# EAGLE design led_board_robot_vs_v2 (EAGLE 8.0.1)
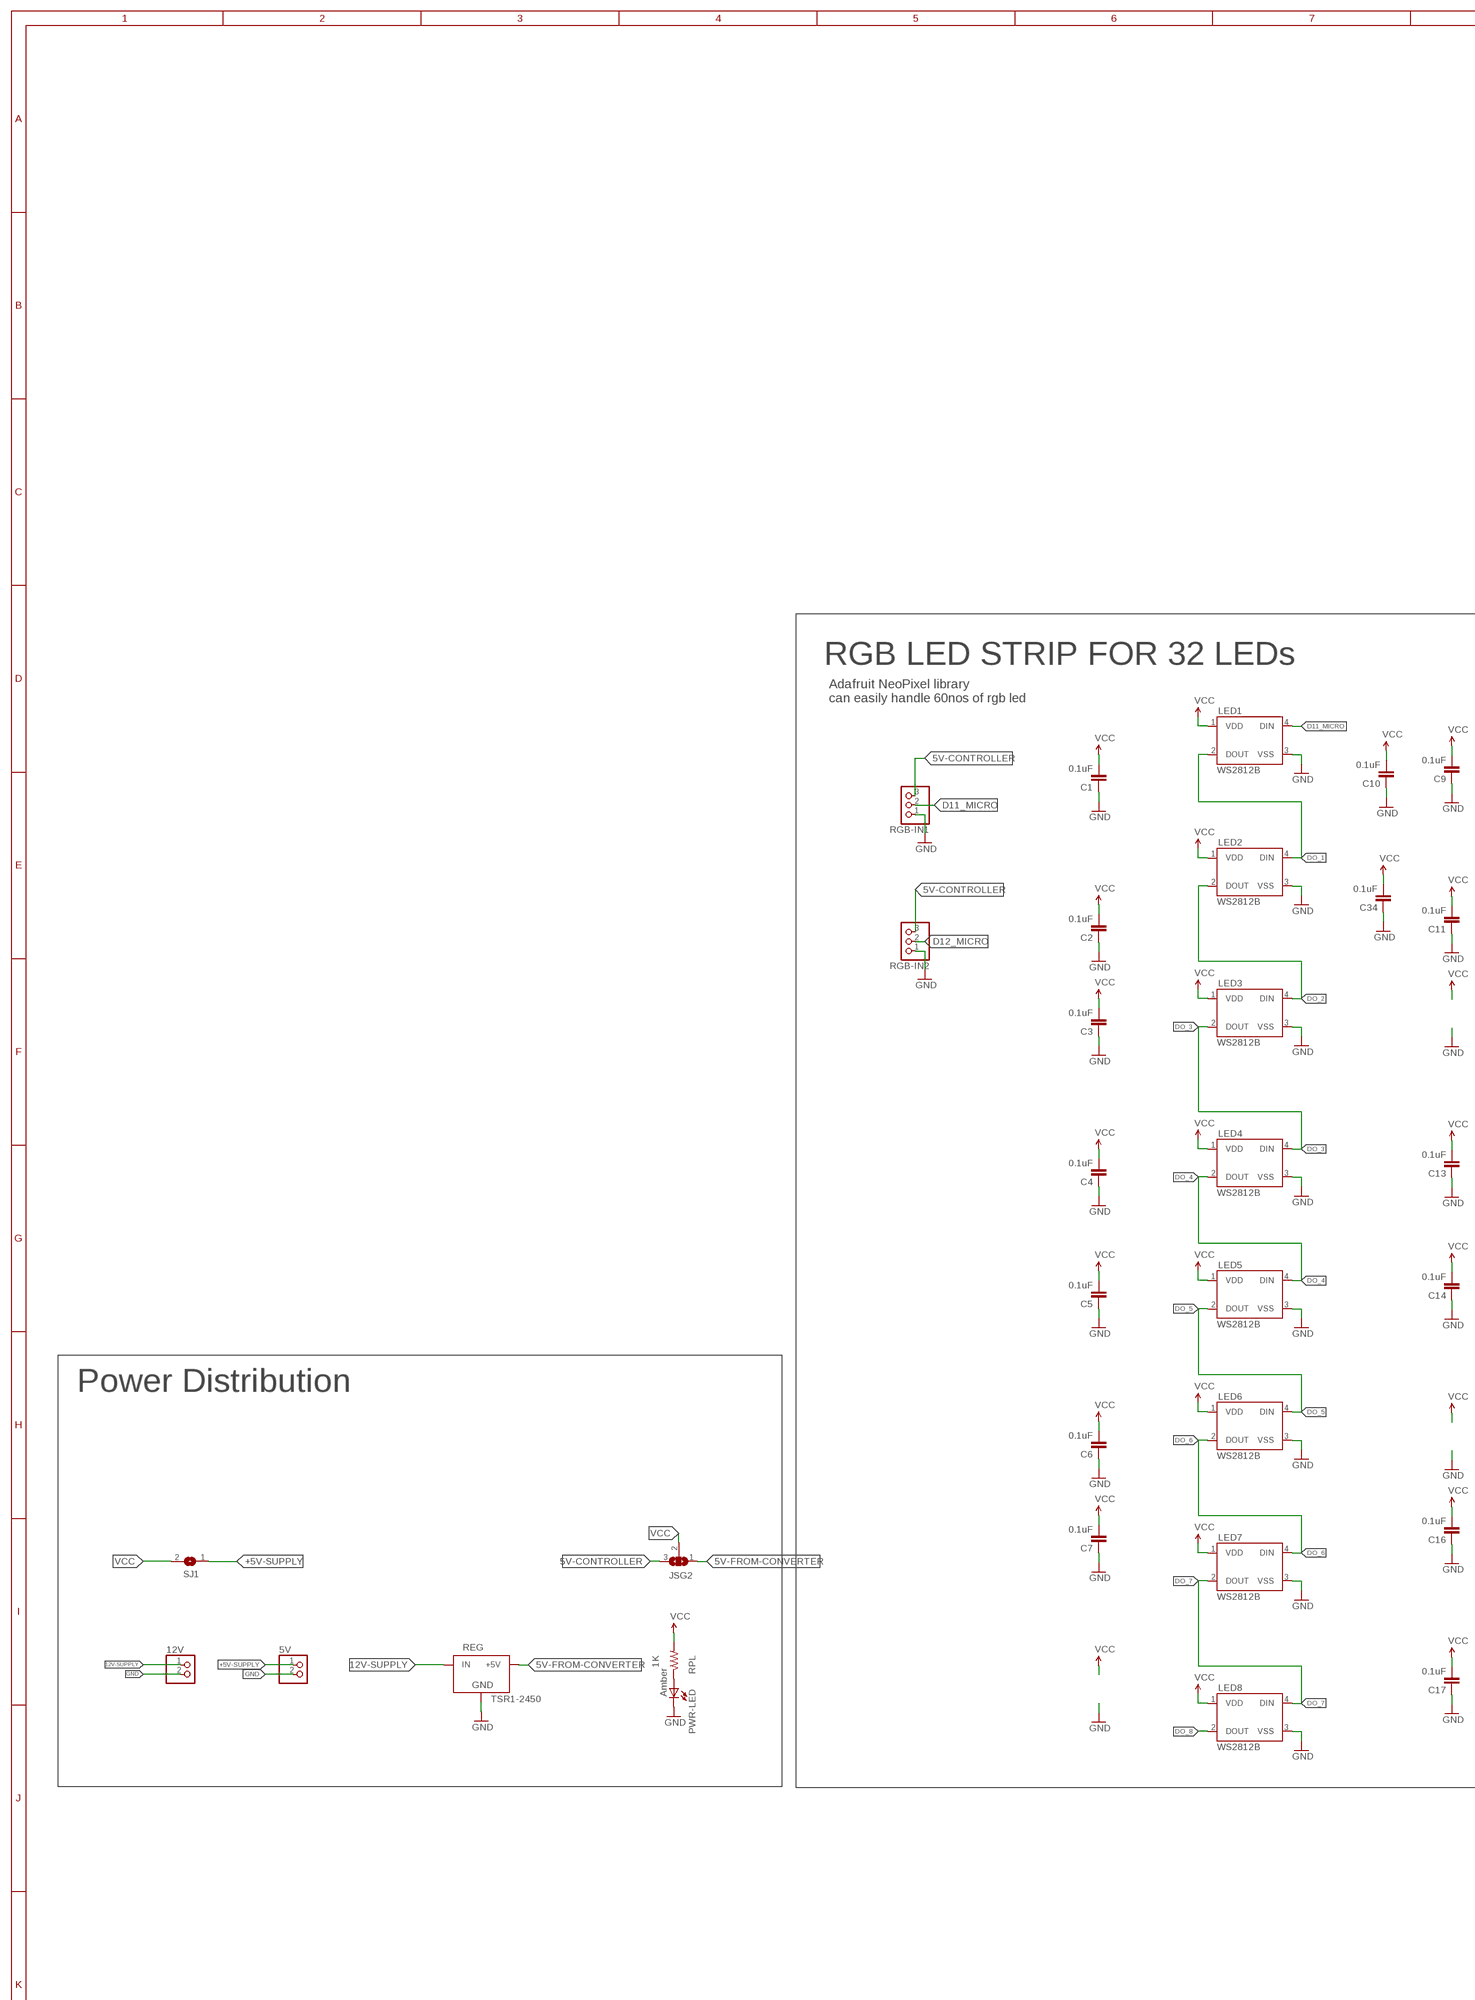
[diagram p0: schematic, sheet 1, part 1 of 3]
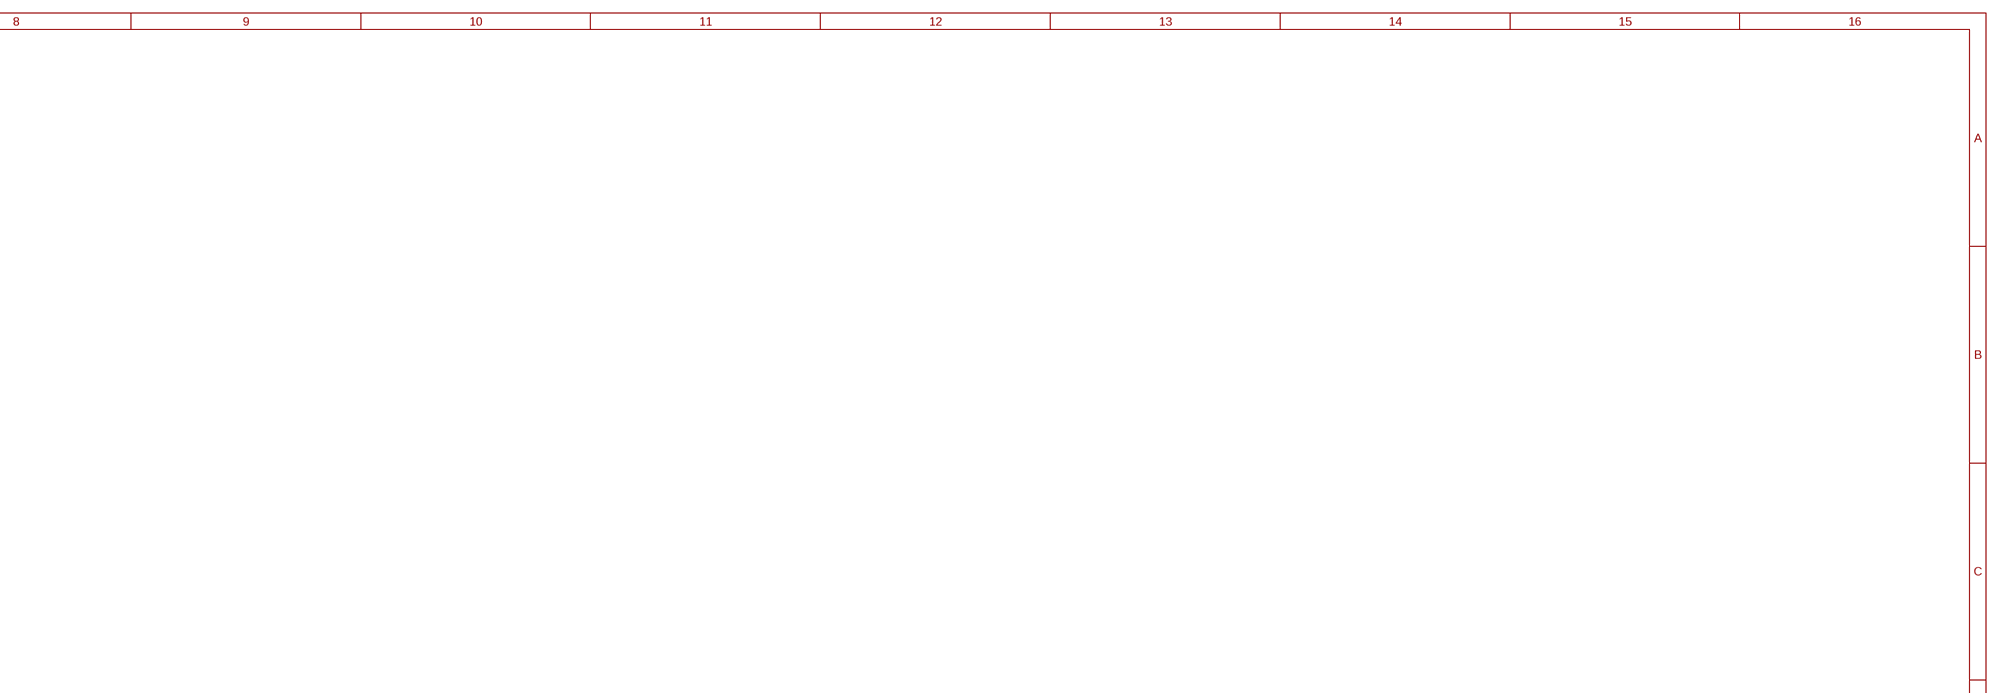
[diagram p1: schematic, sheet 1, part 2 of 3]
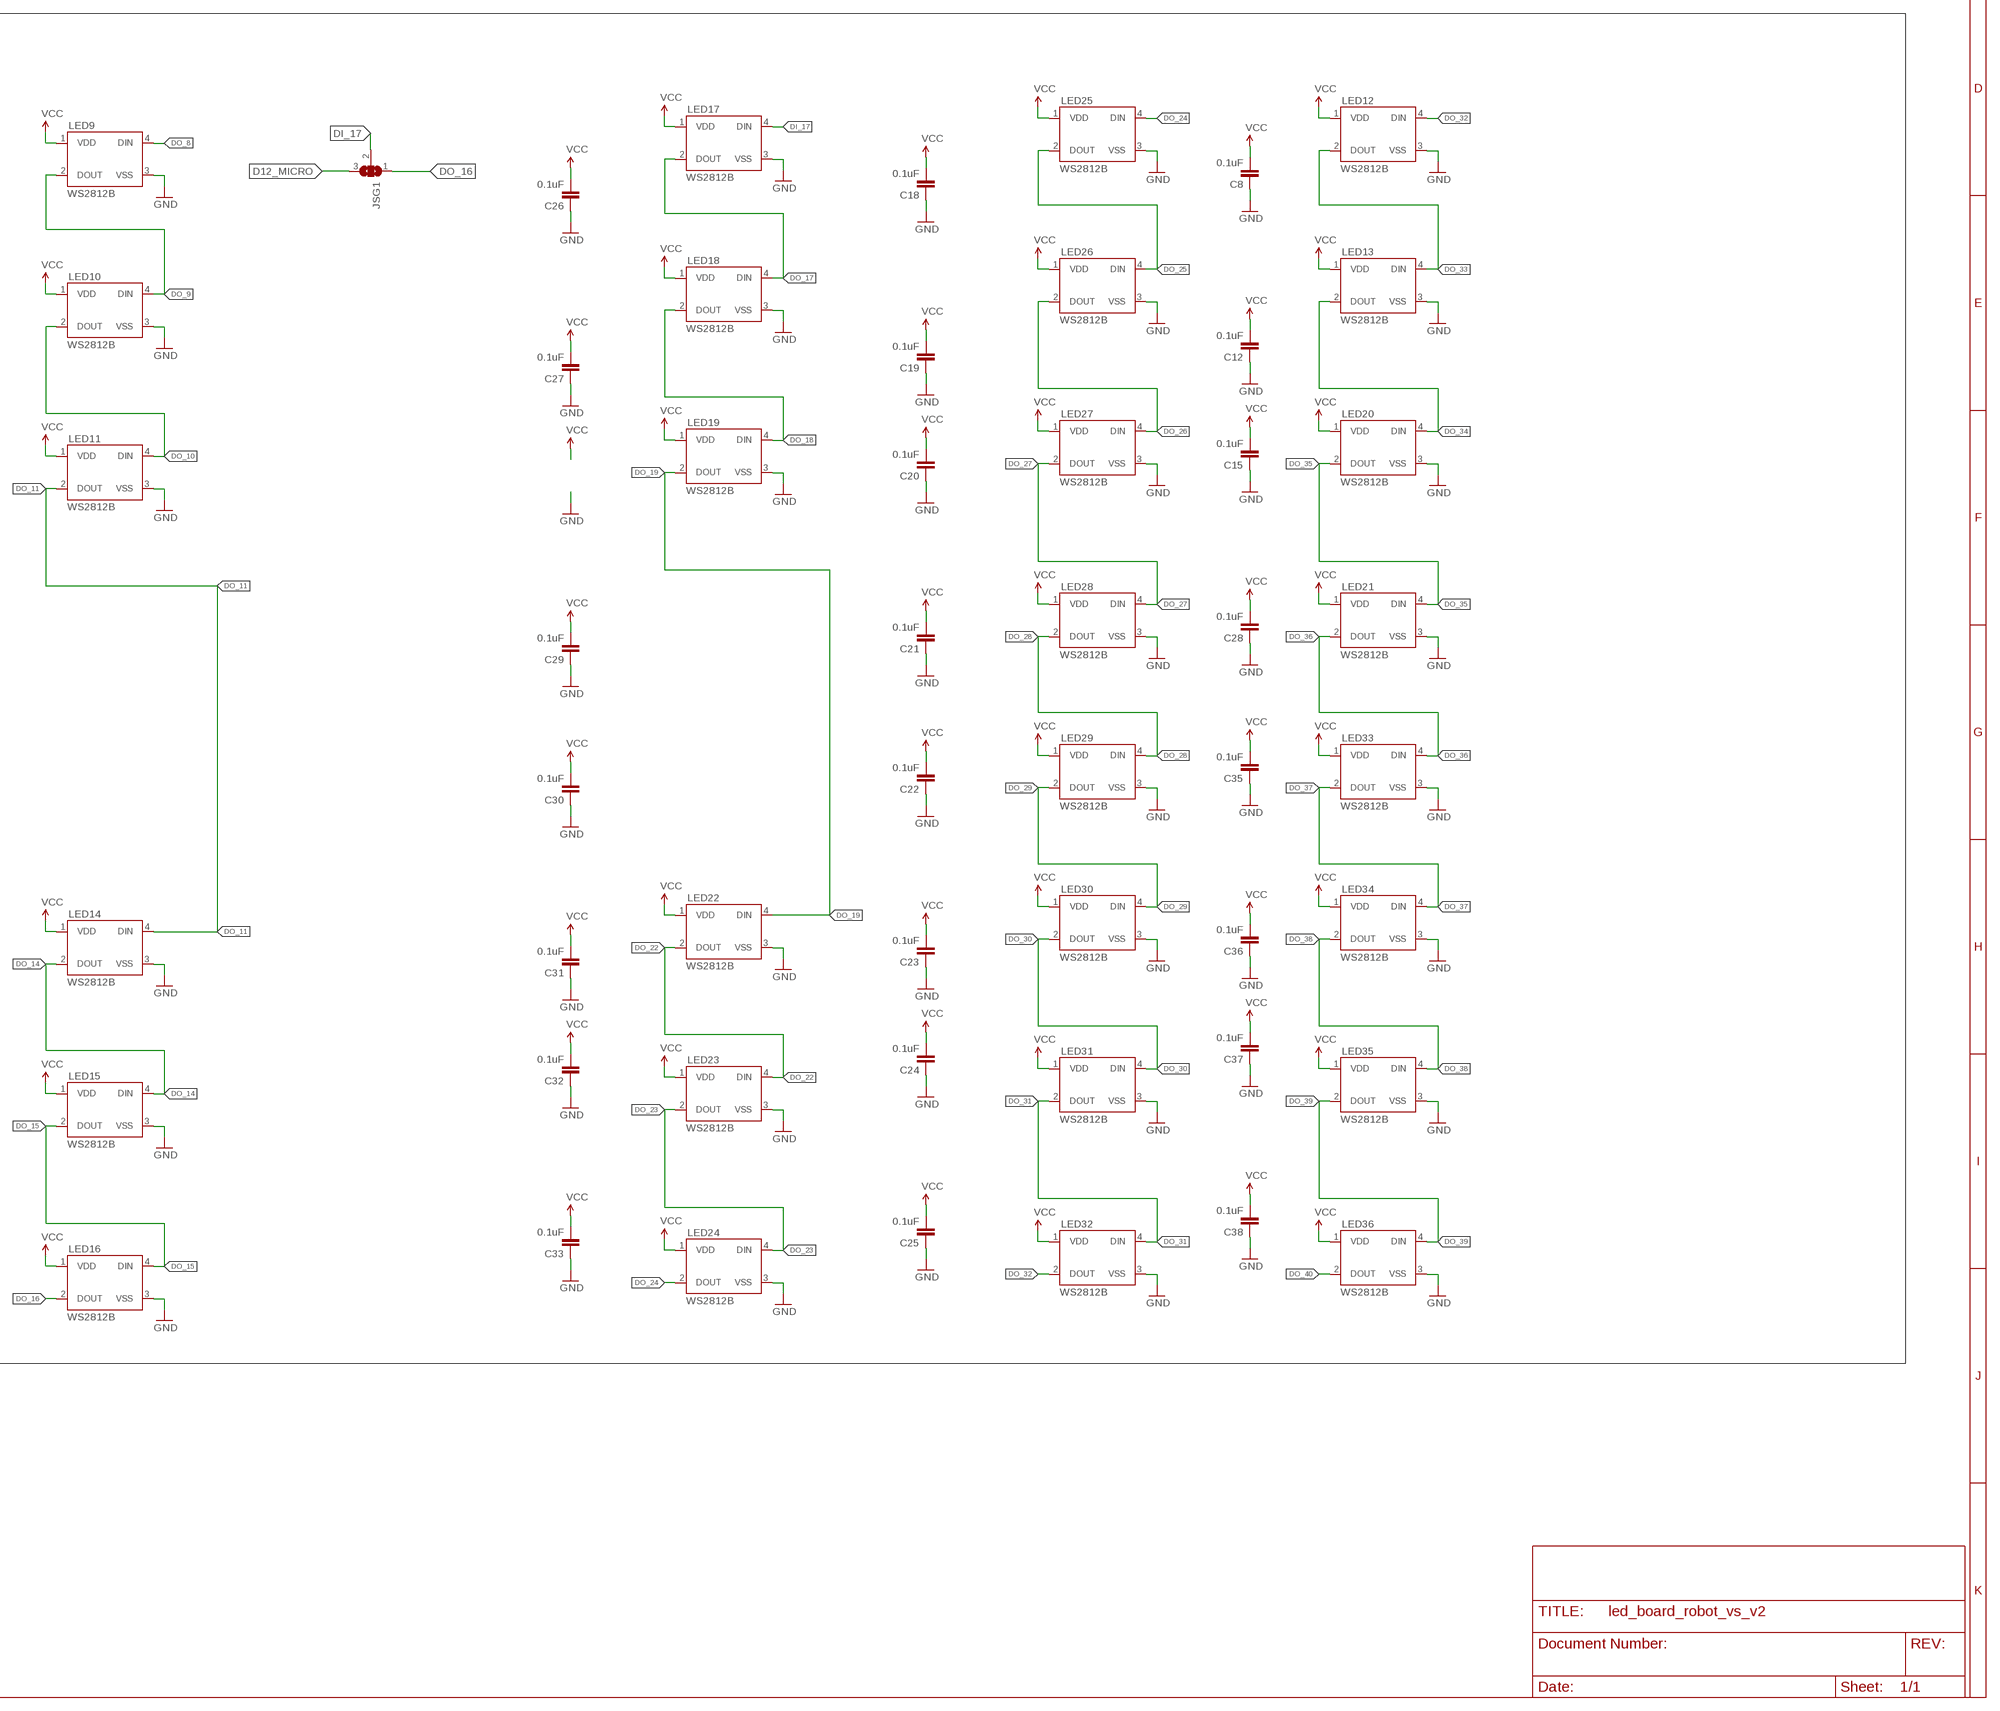
[diagram p2: schematic, sheet 1, part 3 of 3]

## Parts
5V  PINHD-1X2  [1X02]
12V  PINHD-1X2  [1X02]
C1  0.1uF  CAP0603-CAP  [0603-CAP]
C2  0.1uF  CAP0603-CAP  [0603-CAP]
C3  0.1uF  CAP0603-CAP  [0603-CAP]
C4  0.1uF  CAP0603-CAP  [0603-CAP]
C5  0.1uF  CAP0603-CAP  [0603-CAP]
C6  0.1uF  CAP0603-CAP  [0603-CAP]
C7  0.1uF  CAP0603-CAP  [0603-CAP]
C8  0.1uF  CAP0603-CAP  [0603-CAP]
C9  0.1uF  CAP0603-CAP  [0603-CAP]
C10  0.1uF  CAP0603-CAP  [0603-CAP]
C11  0.1uF  CAP0603-CAP  [0603-CAP]
C12  0.1uF  CAP0603-CAP  [0603-CAP]
C13  0.1uF  CAP0603-CAP  [0603-CAP]
C14  0.1uF  CAP0603-CAP  [0603-CAP]
C15  0.1uF  CAP0603-CAP  [0603-CAP]
C16  0.1uF  CAP0603-CAP  [0603-CAP]
C17  0.1uF  CAP0603-CAP  [0603-CAP]
C18  0.1uF  CAP0603-CAP  [0603-CAP]
C19  0.1uF  CAP0603-CAP  [0603-CAP]
C20  0.1uF  CAP0603-CAP  [0603-CAP]
C21  0.1uF  CAP0603-CAP  [0603-CAP]
C22  0.1uF  CAP0603-CAP  [0603-CAP]
C23  0.1uF  CAP0603-CAP  [0603-CAP]
C24  0.1uF  CAP0603-CAP  [0603-CAP]
C25  0.1uF  CAP0603-CAP  [0603-CAP]
C26  0.1uF  CAP0603-CAP  [0603-CAP]
C27  0.1uF  CAP0603-CAP  [0603-CAP]
C28  0.1uF  CAP0603-CAP  [0603-CAP]
C29  0.1uF  CAP0603-CAP  [0603-CAP]
C30  0.1uF  CAP0603-CAP  [0603-CAP]
C31  0.1uF  CAP0603-CAP  [0603-CAP]
C32  0.1uF  CAP0603-CAP  [0603-CAP]
C33  0.1uF  CAP0603-CAP  [0603-CAP]
C34  0.1uF  CAP0603-CAP  [0603-CAP]
C35  0.1uF  CAP0603-CAP  [0603-CAP]
C36  0.1uF  CAP0603-CAP  [0603-CAP]
C37  0.1uF  CAP0603-CAP  [0603-CAP]
C38  0.1uF  CAP0603-CAP  [0603-CAP]
JSG1  SJ2WW  [SJ_2W]
JSG2  SJ2WW  [SJ_2W]
LED1  WS2812B  [WS2812B]
LED2  WS2812B  [WS2812B]
LED3  WS2812B  [WS2812B]
LED4  WS2812B  [WS2812B]
LED5  WS2812B  [WS2812B]
LED6  WS2812B  [WS2812B]
LED7  WS2812B  [WS2812B]
LED8  WS2812B  [WS2812B]
LED9  WS2812B  [WS2812B]
LED10  WS2812B  [WS2812B]
LED11  WS2812B  [WS2812B]
LED12  WS2812B  [WS2812B]
LED13  WS2812B  [WS2812B]
LED14  WS2812B  [WS2812B]
LED15  WS2812B  [WS2812B]
LED16  WS2812B  [WS2812B]
LED17  WS2812B  [WS2812B]
LED18  WS2812B  [WS2812B]
LED19  WS2812B  [WS2812B]
LED20  WS2812B  [WS2812B]
LED21  WS2812B  [WS2812B]
LED22  WS2812B  [WS2812B]
LED23  WS2812B  [WS2812B]
LED24  WS2812B  [WS2812B]
LED25  WS2812B  [WS2812B]
LED26  WS2812B  [WS2812B]
LED27  WS2812B  [WS2812B]
LED28  WS2812B  [WS2812B]
LED29  WS2812B  [WS2812B]
LED30  WS2812B  [WS2812B]
LED31  WS2812B  [WS2812B]
LED32  WS2812B  [WS2812B]
LED33  WS2812B  [WS2812B]
LED34  WS2812B  [WS2812B]
LED35  WS2812B  [WS2812B]
LED36  WS2812B  [WS2812B]
PWR-LED  Amber  LED0603  [LED-0603]
REG  TSR1-2450  [TSR-1]
RGB-IN1  PINHD-1X3  [1X03]
RGB-IN2  PINHD-1X3  [1X03]
RPL  1K  RESISTOR0603-RES  [0603-RES]
SJ1  SJW  [SJW]

## Nets
5V-CONTROLLER [power]: JSG2.3 RGB-IN1.3 RGB-IN2.3
5V-FROM-CONVERTER [power]: JSG2.1 REG.3(+5V)
12V-SUPPLY [power]: 12V.1 REG.1(IN)
+5V-SUPPLY [power]: 5V.1 SJ1.1
D11_MICRO [power]: LED1.4(DIN) RGB-IN1.2
D12_MICRO [power]: JSG1.3 RGB-IN2.2
DI_17: JSG1.2 LED17.4(DIN)
DO_1: LED1.2(DOUT) LED2.4(DIN)
DO_2 [power]: LED2.2(DOUT) LED3.4(DIN)
DO_3 [power]: LED3.2(DOUT) LED4.4(DIN)
DO_4 [power]: LED4.2(DOUT) LED5.4(DIN)
DO_5 [power]: LED5.2(DOUT) LED6.4(DIN)
DO_6 [power]: LED6.2(DOUT) LED7.4(DIN)
DO_7 [power]: LED7.2(DOUT) LED8.4(DIN)
DO_8: LED8.2(DOUT) LED9.4(DIN)
DO_9: LED9.2(DOUT) LED10.4(DIN)
DO_10: LED10.2(DOUT) LED11.4(DIN)
DO_11 [power]: LED11.2(DOUT) LED14.4(DIN)
DO_14 [power]: LED14.2(DOUT) LED15.4(DIN)
DO_15 [power]: LED15.2(DOUT) LED16.4(DIN)
DO_16 [power]: JSG1.1 LED16.2(DOUT)
DO_17 [power]: LED17.2(DOUT) LED18.4(DIN)
DO_18 [power]: LED18.2(DOUT) LED19.4(DIN)
DO_19: LED19.2(DOUT) LED22.4(DIN)
DO_22 [power]: LED22.2(DOUT) LED23.4(DIN)
DO_23 [power]: LED23.2(DOUT) LED24.4(DIN)
DO_24 [power]: LED24.2(DOUT) LED25.4(DIN)
DO_25 [power]: LED25.2(DOUT) LED26.4(DIN)
DO_26 [power]: LED26.2(DOUT) LED27.4(DIN)
DO_27 [power]: LED27.2(DOUT) LED28.4(DIN)
DO_28: LED28.2(DOUT) LED29.4(DIN)
DO_29: LED29.2(DOUT) LED30.4(DIN)
DO_30: LED30.2(DOUT) LED31.4(DIN)
DO_31: LED31.2(DOUT) LED32.4(DIN)
DO_32 [power]: LED12.4(DIN) LED32.2(DOUT)
DO_33 [power]: LED12.2(DOUT) LED13.4(DIN)
DO_34 [power]: LED13.2(DOUT) LED20.4(DIN)
DO_35 [power]: LED20.2(DOUT) LED21.4(DIN)
DO_36: LED21.2(DOUT) LED33.4(DIN)
DO_37: LED33.2(DOUT) LED34.4(DIN)
DO_38: LED34.2(DOUT) LED35.4(DIN)
DO_39: LED35.2(DOUT) LED36.4(DIN)
DO_40 [power]: LED36.2(DOUT)
GND [power]: 5V.2 12V.2 C1.1 C2.1 C3.1 C4.1 C5.1 C6.1 C7.1 C8.1 C9.1 C10.1 C11.1 C12.1 C13.1 C14.1 C15.1 C16.1 C17.1 C18.1 C19.1 C20.1 C21.1 C22.1 C23.1 C24.1 C25.1 C26.1 C27.1 C28.1 C29.1 C30.1 C31.1 C32.1 C33.1 C34.1 C35.1 C36.1 C37.1 C38.1 LED1.3(VSS) LED2.3(VSS) LED3.3(VSS) LED4.3(VSS) LED5.3(VSS) LED6.3(VSS) LED7.3(VSS) LED8.3(VSS) LED9.3(VSS) LED10.3(VSS) LED11.3(VSS) LED12.3(VSS) LED13.3(VSS) LED14.3(VSS) LED15.3(VSS) LED16.3(VSS) LED17.3(VSS) LED18.3(VSS) LED19.3(VSS) LED20.3(VSS) LED21.3(VSS) LED22.3(VSS) LED23.3(VSS) LED24.3(VSS) LED25.3(VSS) LED26.3(VSS) LED27.3(VSS) LED28.3(VSS) LED29.3(VSS) LED30.3(VSS) LED31.3(VSS) LED32.3(VSS) LED33.3(VSS) LED34.3(VSS) LED35.3(VSS) LED36.3(VSS) PWR-LED.C REG.2(GND) RGB-IN1.1 RGB-IN2.1
N$17: PWR-LED.A RPL.1
VCC [power]: C1.2 C2.2 C3.2 C4.2 C5.2 C6.2 C7.2 C8.2 C9.2 C10.2 C11.2 C12.2 C13.2 C14.2 C15.2 C16.2 C17.2 C18.2 C19.2 C20.2 C21.2 C22.2 C23.2 C24.2 C25.2 C26.2 C27.2 C28.2 C29.2 C30.2 C31.2 C32.2 C33.2 C34.2 C35.2 C36.2 C37.2 C38.2 JSG2.2 LED1.1(VDD) LED2.1(VDD) LED3.1(VDD) LED4.1(VDD) LED5.1(VDD) LED6.1(VDD) LED7.1(VDD) LED8.1(VDD) LED9.1(VDD) LED10.1(VDD) LED11.1(VDD) LED12.1(VDD) LED13.1(VDD) LED14.1(VDD) LED15.1(VDD) LED16.1(VDD) LED17.1(VDD) LED18.1(VDD) LED19.1(VDD) LED20.1(VDD) LED21.1(VDD) LED22.1(VDD) LED23.1(VDD) LED24.1(VDD) LED25.1(VDD) LED26.1(VDD) LED27.1(VDD) LED28.1(VDD) LED29.1(VDD) LED30.1(VDD) LED31.1(VDD) LED32.1(VDD) LED33.1(VDD) LED34.1(VDD) LED35.1(VDD) LED36.1(VDD) RPL.2 SJ1.2

## Notes on the sheet
- RGB LED STRIP FOR 32 LEDs
- Adafruit NeoPixel library 
  can easily handle 60nos of rgb led
- Power Distribution

## Library data of the parts
5V 12V = pinhead:PINHD-1X2: PIN HEADER
C1-C38 = SparkFun:CAP: Capacitor Standard 0603 ceramic capacitor, and 0.1" leaded capacitor.
JSG1 JSG2 = jumper:SJ2W: SMD solder JUMPER
LED1-LED36 = SparkFun-LED:WS2812B: WS2812B - Intelligent control LED integrated light source Technical Specifications: Power Supply Voltage (VDD): 3.5 to 5.3 V Input Voltage (VI): -0.5 to VDD+0.5 V Operating Junction Temperature (Topt): -25°C to +80°C Storage Temperature Range (Tstg): -55°C to +150°C; PROD_ID: DIO-12503
PWR-LED = SparkFun:LED: LEDs Standard schematic elements and footprints for 5mm, 3mm, 1206, and 0603 sized LEDs. 5mm - Spark Fun Electronics SKU : COM-00529 (and others)
REG = SteelCaveRobotics-Power:TSR1-2450: Traco Power TSR 1-2450 5.0v switching regulator
RGB-IN1 RGB-IN2 = pinhead:PINHD-1X3: PIN HEADER
RPL = SparkFun:RESISTOR: Resistor Basic schematic elements and footprints for 0603, 1206, and PTH resistors.
SJ1 = jumper:SJ: SMD solder JUMPER

## Net classes
0 default: width 0.762 mm, drill 0.762 mm, clearance 0.559 mm
1 power: width 0.762 mm, drill 0.762 mm, clearance 0.381 mm
2 Massa: width 0.8 mm, drill 0.6 mm, clearance 0.2 mm
3 Mot: width 1.2 mm, drill 0.8 mm, clearance 0.005 mm
4 motor: width 0.305 mm, drill 0.406 mm, clearance 0.203 mm

## Board
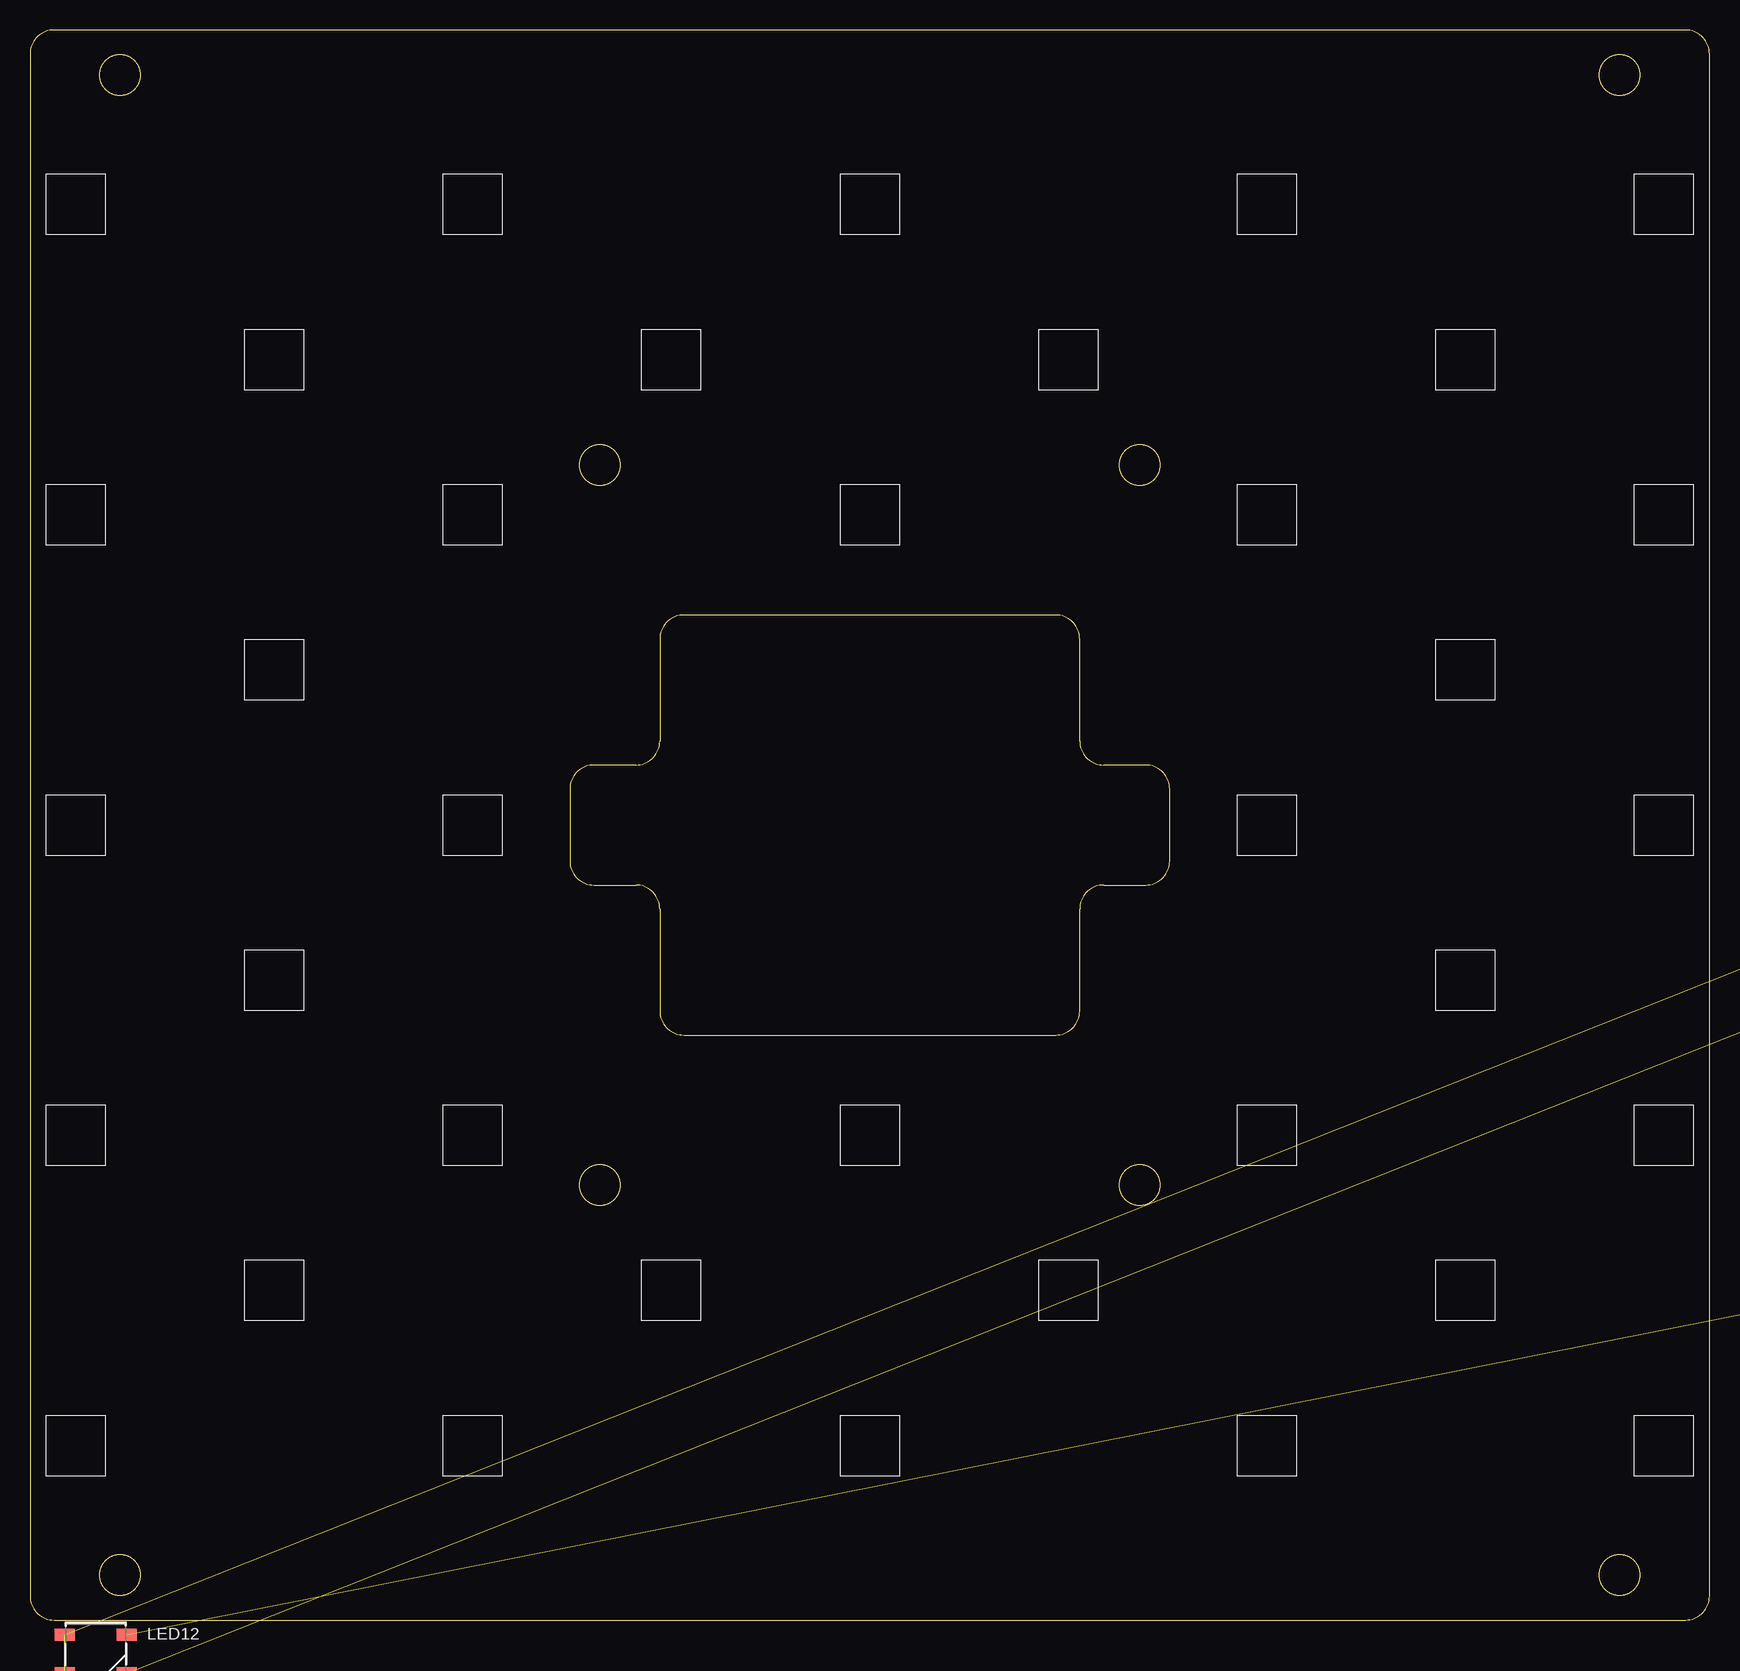
[diagram p3: board, top side]
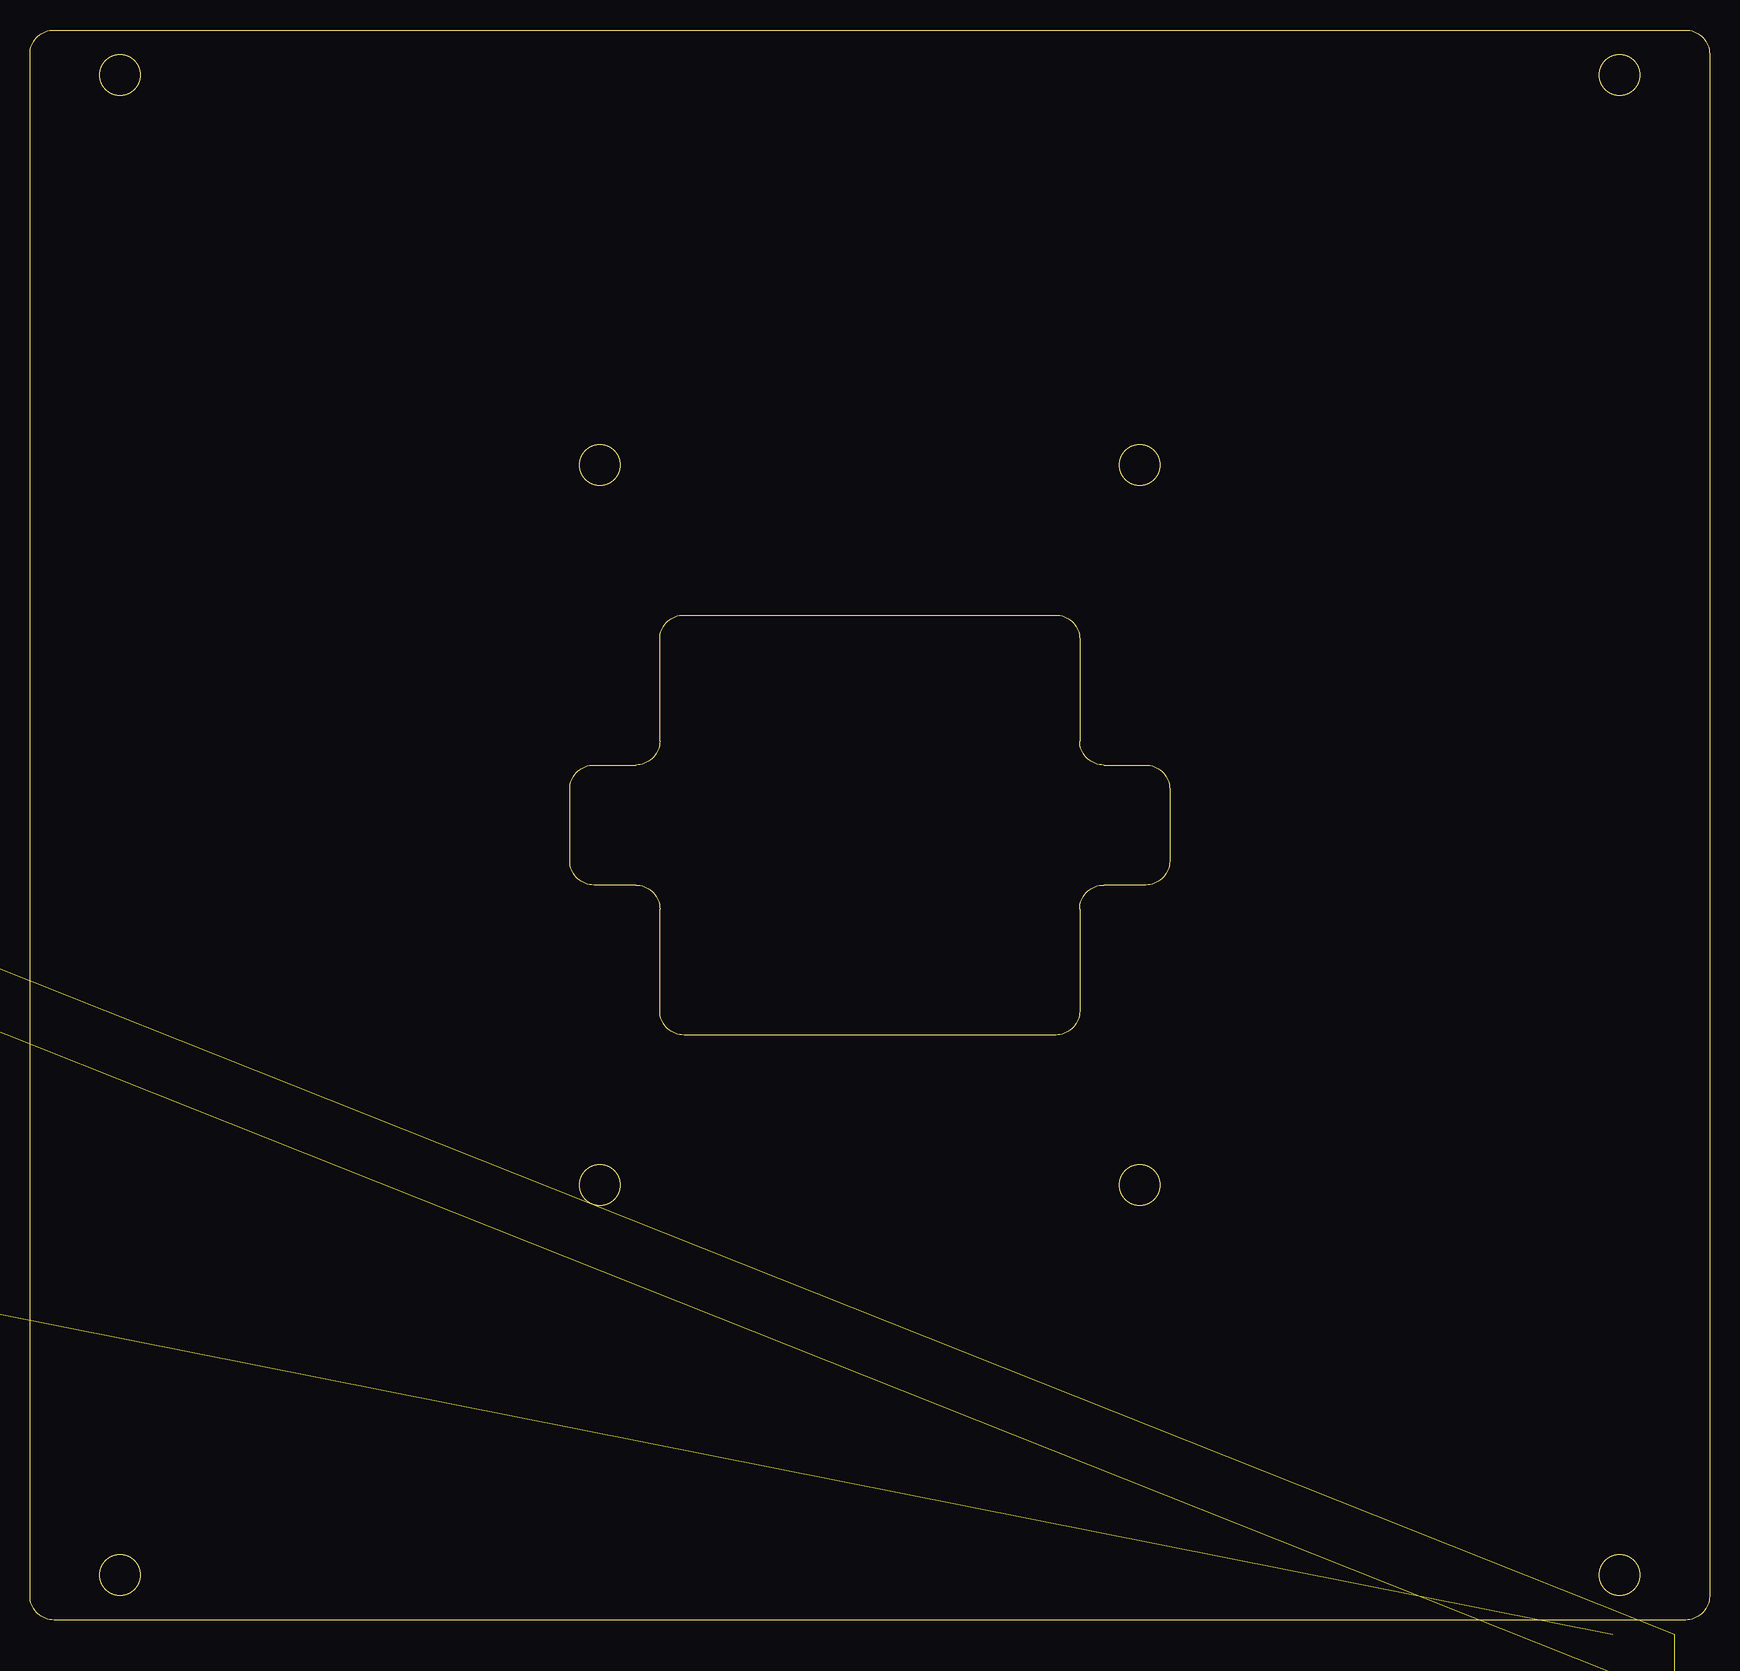
[diagram p4: board, bottom side, seen from below]

Size 140 x 132.5 mm. Coordinates in mm from the lower left corner, seen from the top.
Outline: 2,0 138,0 arc90 140,2 140,130.5 arc90 138,132.5 2,132.5 arc90 0,130.5 0,2 arc90 2,0
Outline: 52.5,59.25 52.5,50.75 arc90 54.5,48.75 85.5,48.75 arc90 87.5,50.75 87.5,59.25 arc-90 89.5,61.25 93,61.25 arc90 95,63.25 95,69.25 arc90 93,71.25 89.5,71.25 arc-90 87.5,73.25 87.5,81.75 arc90 85.5,83.75 54.5,83.75 arc90 52.5,81.75 52.5,73.25 arc-90 50.5,71.25 47,71.25 arc90 45,69.25 45,63.25 arc90 47,61.25 50.5,61.25 arc-90 52.5,59.25
Outline: circle at 132.5,128.75 radius 1.7
Outline: circle at 7.5,3.75 radius 1.7
Outline: circle at 7.5,128.75 radius 1.7
Outline: circle at 132.5,3.75 radius 1.7
Outline: circle at 47.5,96.25 radius 1.7
Outline: circle at 47.5,36.25 radius 1.7
Outline: circle at 92.5,96.25 radius 1.7
Outline: circle at 92.5,36.25 radius 1.7
Copper layers (1*16): Top 0.035mm / dielectric 1.5mm / Bottom 0.035mm
Design rules "default": minimum track width 10mil, minimum drill 24mil, track to track 8mil, track to pad 8mil, pad to pad 8mil, via to via 8mil, smd to smd 8mil, copper to edge 40mil, drill to drill 8mil, minimum pad ring 10mil, minimum via ring 8mil, stop-mask expansion 4mil, vias tented up to drill 0mil, thermal gap 10mil

### Footprints (pad centres in the part's own frame; a part is rotated, then mirrored left to right if it is on the bottom)
1X02 = drill 1.016 long: 1 -1.27,0; 2 1.27,0
0603-CAP = smd 1.1 x 1: 1 -0.85,0; 2 0.85,0
SJ_2W = smd 1.27 x 2.54: 1 -2.54,0; 2 0,0; 3 2.54,0
WS2812B = smd 1.651 x 1: 1 -2.577,1.6; 2 -2.577,-1.6; 3 2.577,-1.6; 4 2.577,1.6
LED-0603 = smd 0.8 x 0.8: A 0,-0.75; C 0,0.75
TSR-1 = drill 0.8 pad 1.8 square: 1 -2.54,-1.5 | drill 0.8 pad 1.8 octagon: 2 0,-1.5; 3 2.54,-1.5
1X03 = drill 1.016 long: 1 -2.54,0; 2 0,0; 3 2.54,0
0603-RES = smd 1.1 x 1: 1 -0.85,0; 2 0.85,0
SJW = smd 1.27 x 2.54: 1 -1.27,0; 2 1.27,0

### Placement (x,y rotation side)
5V  279.04,221.01 180 top  (outside the outline)
12V  287.29,221.01 180 top  (outside the outline)
C1  410.67,98.45 90 top  (outside the outline)
C2  515.13,98.55 90 top  (outside the outline)
C3  480.13,98.55 90 top  (outside the outline)
C4  339.63,98.55 90 top  (outside the outline)
C5  304.83,98.55 90 top  (outside the outline)
C6  269.13,98.35 90 top  (outside the outline)
C7  514.13,134.55 90 top  (outside the outline)
C8  2.69,-46.02 0 top  (outside the outline)
C9  478.83,134.65 90 top  (outside the outline)
C10  445.97,98.36 90 top  (outside the outline)
C11  442.93,134.55 90 top  (outside the outline)
C12  8.28,-46.02 0 top  (outside the outline)
C13  322.43,134.55 90 top  (outside the outline)
C14  304.23,134.65 90 top  (outside the outline)
C15  2.69,-49.07 0 top  (outside the outline)
C16  268.93,134.45 90 top  (outside the outline)
C17  443.53,170.45 90 top  (outside the outline)
C18  304.96,220 270 top  (outside the outline)
C19  269.73,206.35 90 top  (outside the outline)
C20  374.73,98.45 90 top  (outside the outline)
C21  304.73,206.15 90 top  (outside the outline)
C22  267.73,170.35 90 top  (outside the outline)
C23  339.63,206.55 90 top  (outside the outline)
C24  304.13,170.35 90 top  (outside the outline)
C25  373.53,206.65 90 top  (outside the outline)
C26  323.02,170.66 90 top  (outside the outline)
C27  408.33,206.55 90 top  (outside the outline)
C28  8.28,-49.07 0 top  (outside the outline)
C29  443.93,206.55 90 top  (outside the outline)
C30  478.93,170.55 90 top  (outside the outline)
C31  479.53,206.55 90 top  (outside the outline)
C32  514.73,170.55 90 top  (outside the outline)
C33  515.13,206.65 90 top  (outside the outline)
C34  308.82,220 270 top  (outside the outline)
C35  2.69,-52.11 0 top  (outside the outline)
C36  8.28,-52.11 0 top  (outside the outline)
C37  2.69,-55.16 0 top  (outside the outline)
C38  8.28,-55.16 0 top  (outside the outline)
JSG1  325.03,217.09 270 top  (outside the outline)
JSG2  313.21,217.09 270 top  (outside the outline)
LED1  260.97,206.66 0 top  (outside the outline)
LED2  295.97,206.66 0 top  (outside the outline)
LED3  330.97,206.66 0 top  (outside the outline)
LED4  365.97,206.66 0 top  (outside the outline)
LED5  400.97,206.66 0 top  (outside the outline)
LED6  435.97,206.66 0 top  (outside the outline)
LED7  470.97,206.66 0 top  (outside the outline)
LED8  505.97,206.66 0 top  (outside the outline)
LED9  260.97,170.66 0 top  (outside the outline)
LED10  295.97,170.66 0 top  (outside the outline)
LED11  330.97,170.66 0 top  (outside the outline)
LED12  5.48,-2.84 0 top
LED13  5.48,-8.43 0 top  (outside the outline)
LED14  435.97,170.66 0 top  (outside the outline)
LED15  470.97,170.66 0 top  (outside the outline)
LED16  505.97,170.66 0 top  (outside the outline)
LED17  260.97,134.66 0 top  (outside the outline)
LED18  295.97,134.66 0 top  (outside the outline)
LED19  330.97,134.66 0 top  (outside the outline)
LED20  5.48,-14.01 0 top  (outside the outline)
LED21  5.48,-19.6 0 top  (outside the outline)
LED22  435.97,134.66 0 top  (outside the outline)
LED23  470.97,134.66 0 top  (outside the outline)
LED24  505.97,134.66 0 top  (outside the outline)
LED25  260.97,98.66 0 top  (outside the outline)
LED26  295.97,98.66 0 top  (outside the outline)
LED27  330.97,98.66 0 top  (outside the outline)
LED28  365.97,98.66 0 top  (outside the outline)
LED29  400.97,98.66 0 top  (outside the outline)
LED30  435.97,98.66 0 top  (outside the outline)
LED31  470.97,98.66 0 top  (outside the outline)
LED32  505.97,98.66 0 top  (outside the outline)
LED33  5.48,-25.19 0 top  (outside the outline)
LED34  5.48,-30.78 0 top  (outside the outline)
LED35  5.48,-36.37 0 top  (outside the outline)
LED36  5.48,-41.95 0 top  (outside the outline)
PWR-LED  308.82,215.41 0 top  (outside the outline)
REG  281.35,208.68 180 top  (outside the outline)
RGB-IN1  270.83,221.03 0 bottom  (outside the outline)
RGB-IN2  261.25,221.01 0 bottom  (outside the outline)
RPL  304.96,215.72 90 top  (outside the outline)
SJ1  319.29,215.88 90 top  (outside the outline)

### Tracks (layer width: path | path; a pad name or v marks a point on that pad's centre or on a via)
5V-CONTROLLER  (2 unrouted)
5V-FROM-CONVERTER  (1 unrouted)
12V-SUPPLY  (1 unrouted)
+5V-SUPPLY  (1 unrouted)
D11_MICRO  (1 unrouted)
D12_MICRO  (1 unrouted)
DI_17  (1 unrouted)
DO_1  (1 unrouted)
DO_2  (1 unrouted)
DO_3  (1 unrouted)
DO_4  (1 unrouted)
DO_5  (1 unrouted)
DO_6  (1 unrouted)
DO_7  (1 unrouted)
DO_8  (1 unrouted)
DO_9  (1 unrouted)
DO_10  (1 unrouted)
DO_11  (1 unrouted)
DO_14  (1 unrouted)
DO_15  (1 unrouted)
DO_16  (1 unrouted)
DO_17  (1 unrouted)
DO_18  (1 unrouted)
DO_19  (1 unrouted)
DO_22  (1 unrouted)
DO_23  (1 unrouted)
DO_24  (1 unrouted)
DO_25  (1 unrouted)
DO_26  (1 unrouted)
DO_27  (1 unrouted)
DO_28  (1 unrouted)
DO_29  (1 unrouted)
DO_30  (1 unrouted)
DO_31  (1 unrouted)
DO_32  (1 unrouted)
DO_33  (1 unrouted)
DO_34  (1 unrouted)
DO_35  (1 unrouted)
DO_36  (1 unrouted)
DO_37  (1 unrouted)
DO_38  (1 unrouted)
DO_39  (1 unrouted)
GND  (79 unrouted)
N$1  (via drill 3.3)
  other vias: 250.68,81.16
N$2  (via drill 3.3)
  other vias: 515.68,81.16
N$3  (via drill 3.3)
  other vias: 515.68,221.16
N$4  (via drill 3.3)
  other vias: 250.68,221.16
N$17  (1 unrouted)
VCC  (76 unrouted)
(copper drawn outside any net)
  shapes: Bottom area x4, Top area x4

### Text on the board
tNames: - | + | + | - | - | + | - | +
Document: LED_BOARD_ROBOT_VS_V2